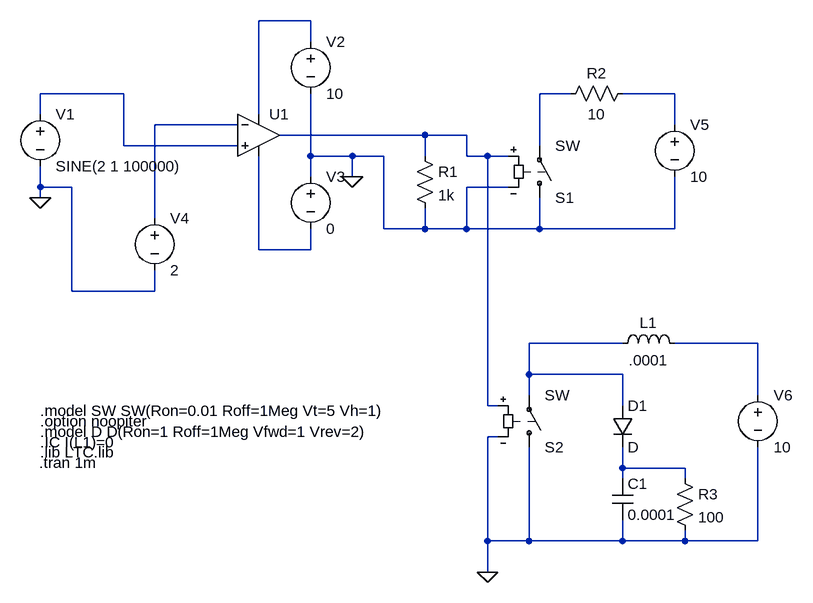
[diagram p0: schematic Vswitch.asc]
Vswitch.asc, the LTspice schematic file:
Version 4
SHEET 1 1548 788
WIRE 560 -144 480 -144
WIRE 560 -112 560 -144
WIRE 272 -32 144 -32
WIRE 960 -32 912 -32
WIRE 1120 -32 1040 -32
WIRE 144 0 144 -32
WIRE 480 0 480 -144
WIRE 448 16 320 16
WIRE 1120 16 1120 -32
WIRE 736 32 512 32
WIRE 800 32 736 32
WIRE 272 48 272 -32
WIRE 448 48 272 48
WIRE 912 48 912 -32
WIRE 560 64 560 -32
WIRE 624 64 560 64
WIRE 672 64 624 64
WIRE 736 64 736 32
WIRE 800 64 800 32
WIRE 832 64 800 64
WIRE 864 64 832 64
WIRE 560 96 560 64
WIRE 624 96 624 64
WIRE 144 112 144 80
WIRE 192 112 144 112
WIRE 864 112 800 112
WIRE 144 128 144 112
WIRE 320 160 320 16
WIRE 672 176 672 64
WIRE 736 176 736 144
WIRE 736 176 672 176
WIRE 800 176 800 112
WIRE 800 176 736 176
WIRE 912 176 912 128
WIRE 912 176 800 176
WIRE 1120 176 1120 96
WIRE 1120 176 912 176
WIRE 480 208 480 64
WIRE 560 208 560 176
WIRE 560 208 480 208
WIRE 192 272 192 112
WIRE 320 272 320 240
WIRE 320 272 192 272
WIRE 1040 352 896 352
WIRE 1248 352 1120 352
WIRE 896 400 896 352
WIRE 1040 400 896 400
WIRE 896 432 896 400
WIRE 1248 432 1248 352
WIRE 832 448 832 64
WIRE 848 448 832 448
WIRE 1040 448 1040 400
WIRE 848 496 832 496
WIRE 1040 544 1040 512
WIRE 1136 544 1040 544
WIRE 1040 560 1040 544
WIRE 1136 560 1136 544
WIRE 832 656 832 496
WIRE 896 656 896 512
WIRE 896 656 832 656
WIRE 1040 656 1040 624
WIRE 1040 656 896 656
WIRE 1136 656 1136 640
WIRE 1136 656 1040 656
WIRE 1248 656 1248 512
WIRE 1248 656 1136 656
WIRE 832 704 832 656
FLAG 144 128 0
FLAG 624 96 0
FLAG 832 704 0
SYMBOL voltage 144 -16 R0
WINDOW 123 0 0 Left 0
WINDOW 39 0 0 Left 0
SYMATTR InstName V1
SYMATTR Value SINE(2 1 100000)
SYMBOL voltage 560 -128 R0
WINDOW 123 0 0 Left 0
WINDOW 39 0 0 Left 0
SYMATTR InstName V2
SYMATTR Value 10
SYMBOL voltage 560 80 R0
WINDOW 123 0 0 Left 0
WINDOW 39 0 0 Left 0
SYMATTR InstName V3
SYMATTR Value 0
SYMBOL res 720 48 R0
SYMATTR InstName R1
SYMATTR Value 1k
SYMBOL OpAmps\\UniversalOpamp2 480 32 R0
SYMATTR InstName U1
SYMBOL voltage 320 144 R0
WINDOW 123 0 0 Left 0
WINDOW 39 0 0 Left 0
SYMATTR InstName V4
SYMATTR Value 2
SYMBOL sw 912 144 M180
SYMATTR InstName S1
SYMBOL voltage 1120 0 R0
WINDOW 123 0 0 Left 0
WINDOW 39 0 0 Left 0
SYMATTR InstName V5
SYMATTR Value 10
SYMBOL res 1056 -48 R90
WINDOW 0 0 56 VBottom 2
WINDOW 3 32 56 VTop 2
SYMATTR InstName R2
SYMATTR Value 10
SYMBOL sw 896 528 M180
SYMATTR InstName S2
SYMBOL ind 1136 368 M270
WINDOW 0 32 56 VTop 2
WINDOW 3 5 56 VBottom 2
SYMATTR InstName L1
SYMATTR Value .0001
SYMBOL voltage 1248 416 R0
WINDOW 123 0 0 Left 0
WINDOW 39 0 0 Left 0
SYMATTR InstName V6
SYMATTR Value 10
SYMBOL diode 1024 448 R0
SYMATTR InstName D1
SYMBOL cap 1024 560 R0
SYMATTR InstName C1
SYMATTR Value 0.0001
SYMBOL res 1120 544 R0
SYMATTR InstName R3
SYMATTR Value 100
TEXT 142 536 Left 2 !.tran 1m
TEXT 144 520 Left 2 !.lib LTC.lib
TEXT 144 456 Left 2 !.model SW SW(Ron=0.01 Roff=1Meg Vt=5 Vh=1)
TEXT 144 472 Left 2 !.option noopiter
TEXT 144 488 Left 2 !.model D D(Ron=1 Roff=1Meg Vfwd=1 Vrev=2)
TEXT 144 504 Left 2 !.IC I(L1)=0

The netlist it stands for:
* Vswitch.asc
V1 N002 0 SINE(2 1 100000)
V2 N001 0 10
V3 0 N007 0
R1 N006 0 1k
XU1 N002 N005 N001 N007 N006 level.2 Avol=1Meg GBW=10Meg Slew=10Meg ilimit=25m rail=0 Vos=0 phimargin=45 en=0 enk=0 in=0 ink=0 Rin=500Meg  ; pins IN+ IN- V+ V- OUT
V4 N005 0 2
S1 0 N003 N006 0 SW
V5 N004 0 10
R2 N004 N003 10
S2 0 N008 N006 0 SW
L1 N009 N008 .0001
V6 N009 0 10
D1 N008 N010 D
C1 N010 0 0.0001
R3 N010 0 100
.model D D
.lib standard.dio
.tran 1m
.lib LTC.lib
.model SW SW(Ron=0.01 Roff=1Meg Vt=5 Vh=1)
.option noopiter
.model D D(Ron=1 Roff=1Meg Vfwd=1 Vrev=2)
.IC I(L1)=0
.lib UniversalOpamps2.sub
.backanno
.end